# Altium project STM8 Oscillograph.PrjPcb
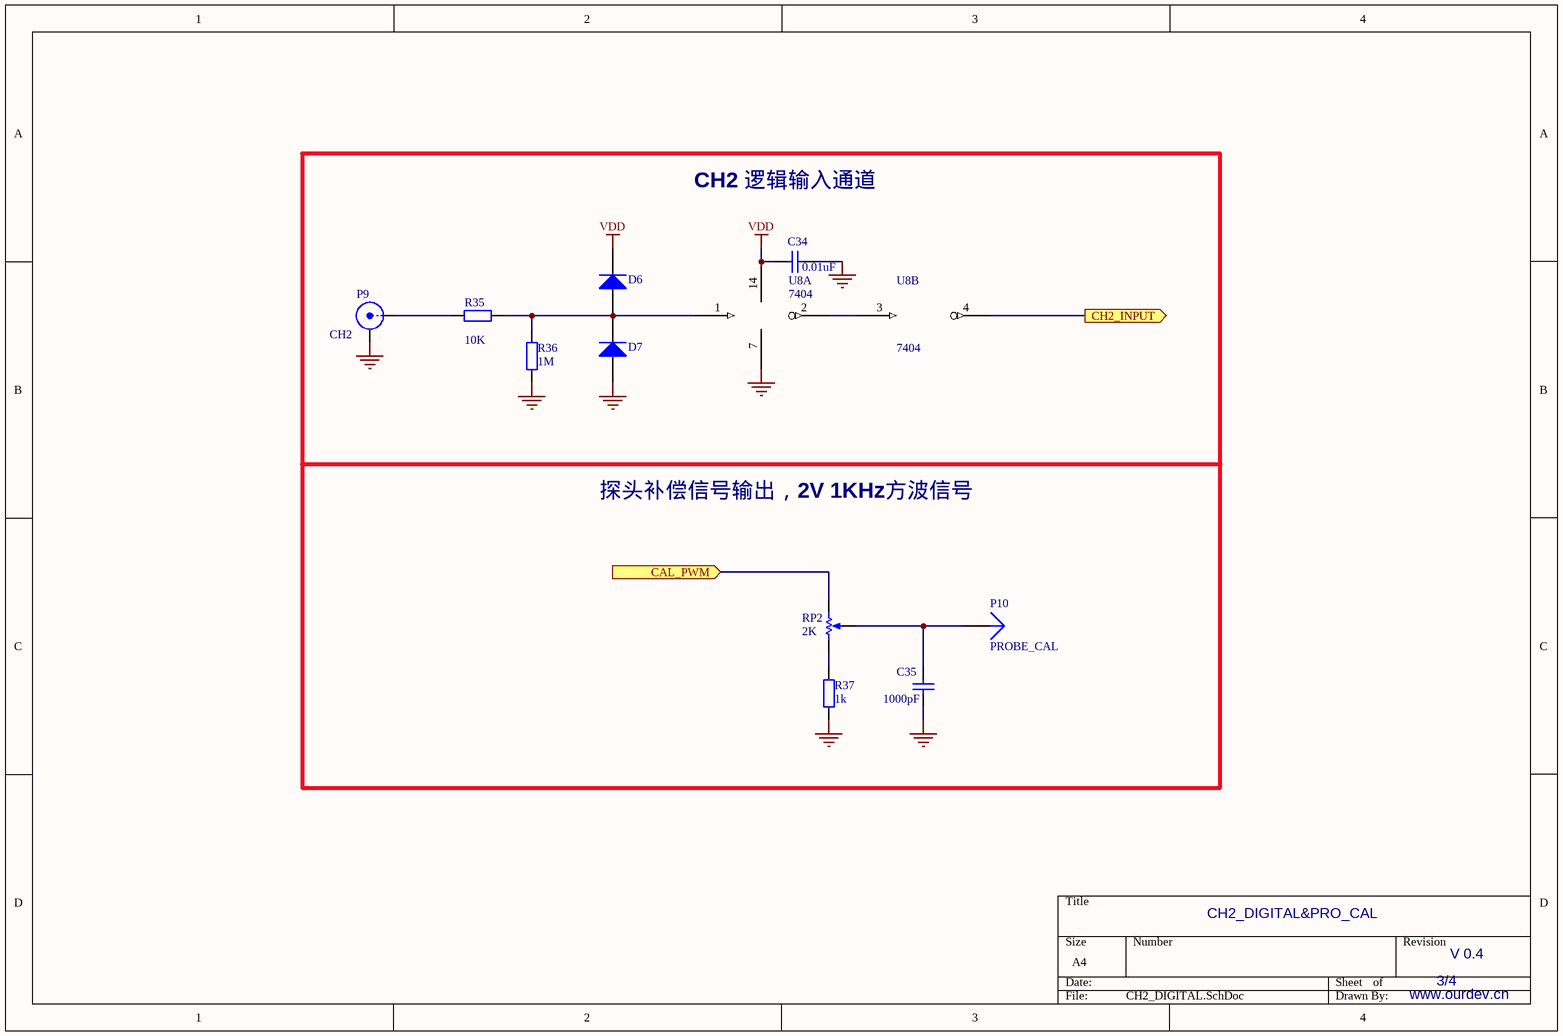
[diagram p0: CH2_DIGITAL.SchDoc]
1 sheet, 11 parts. Net scope: flat (ports and power ports of the same name join across sheets).
Board file: STM8 Oscillograph.PcbDoc

## Sheet CH2_DIGITAL.SchDoc
size A4; DocumentNumber: 3; SheetNumber: 3; SheetTotal: 4

### Parts
C34  value 0.01uF  [CC2012-0805]  (hidden comment: Cap)
C35  value 1000pF  [CC2012-0805]  (hidden comment: Cap)
D6  Diode  [SMA]  (value not drawn)
D7  Diode  [SMA]  (value not drawn)
P9  CH2  [BNC_RA CON]
P10  PROBE_CAL  [PIN1]
R35  value 10K  [CR2012-0805]  (hidden comment: Res2)
R36  value 1M  [CR2012-0805]  (hidden comment: Res2)
R37  value 1k  [CR2012-0805]  (hidden comment: Res2)
RP2  2K  [VR]
U8  7404  [SO-14]  (parts A,B of 6)

### Ports
CAL_PWM (in), CH2_INPUT (out)

### Nets
GND: C34.1 C35.1 D7.1(A) P9.2(Y) R36.1 R37.2 U8.7
VDD: C34.2 D6.2(K) U8.14
NetC35_2: C35.2 P10.1 RP2.2(TAP)
NetD6_1: D6.1(A) D7.2(K) R35.2 R36.2 U8.1
NetP9_1: P9.1(X) R35.1
NetR37_1: R37.1 RP2.1(TOP)
NetRP2_3: RP2.3(BOT) ; port CAL_PWM
NetU8_2: U8.2 U8.3
NetU8_4: U8.4 ; port CH2_INPUT

### Notes on the sheet
- CH2 逻辑输入通道
- 探头补偿信号输出，2V 1KHz方波信号
- CH2_DIGITAL&PRO_CAL
- 3/4
- V 0.4
- www.ourdev.cn

### Library data of the parts
C34 C35 = Cap: Capacitor; Published: 8-Jun-2000; LatestRevisionDate: 17-Jul-2002; LatestRevisionNote: Re-released for DXP Platform.; PackageReference: RAD-0.3; Publisher: Altium Limited
D6 D7 = Diode: Default Diode; Published: 8-Jun-2000; LatestRevisionDate: 17-Jul-2002; LatestRevisionNote: Re-released for DXP Platform.; PackageDocument: Sep-1996; PackageReference: SMC; Publisher: Altium Limited; Code_JEDEC: DO-214-AB
P9 = BNC: BNC Elbow Connector; LatestRevisionDate: 17-Jul-2002; LatestRevisionNote: Re-released for DXP Platform.; Publisher: Altium Limited
P10 = Plug: LatestRevisionDate: 17-Jul-2002; LatestRevisionNote: Re-released for DXP Platform.; Publisher: Altium Limited
R35-R37 = Res2: Resistor; Published: 8-Jun-2000; LatestRevisionDate: 17-Jul-2002; LatestRevisionNote: Re-released for DXP Platform.; PackageReference: AXIAL-0.4; Publisher: Altium Limited
RP2 = RPot: Potentiometer; Sim Note: Enter the Resistance value and the set point into parameter fields.; Set Position: 0.5; Published: 8-Jun-2000; LatestRevisionDate: 17-Jul-2002; LatestRevisionNote: Re-released for DXP Platform.; PackageReference: VR5; Publisher: Altium Limited; Value: 2K